# Altium project main-board.PrjPcb
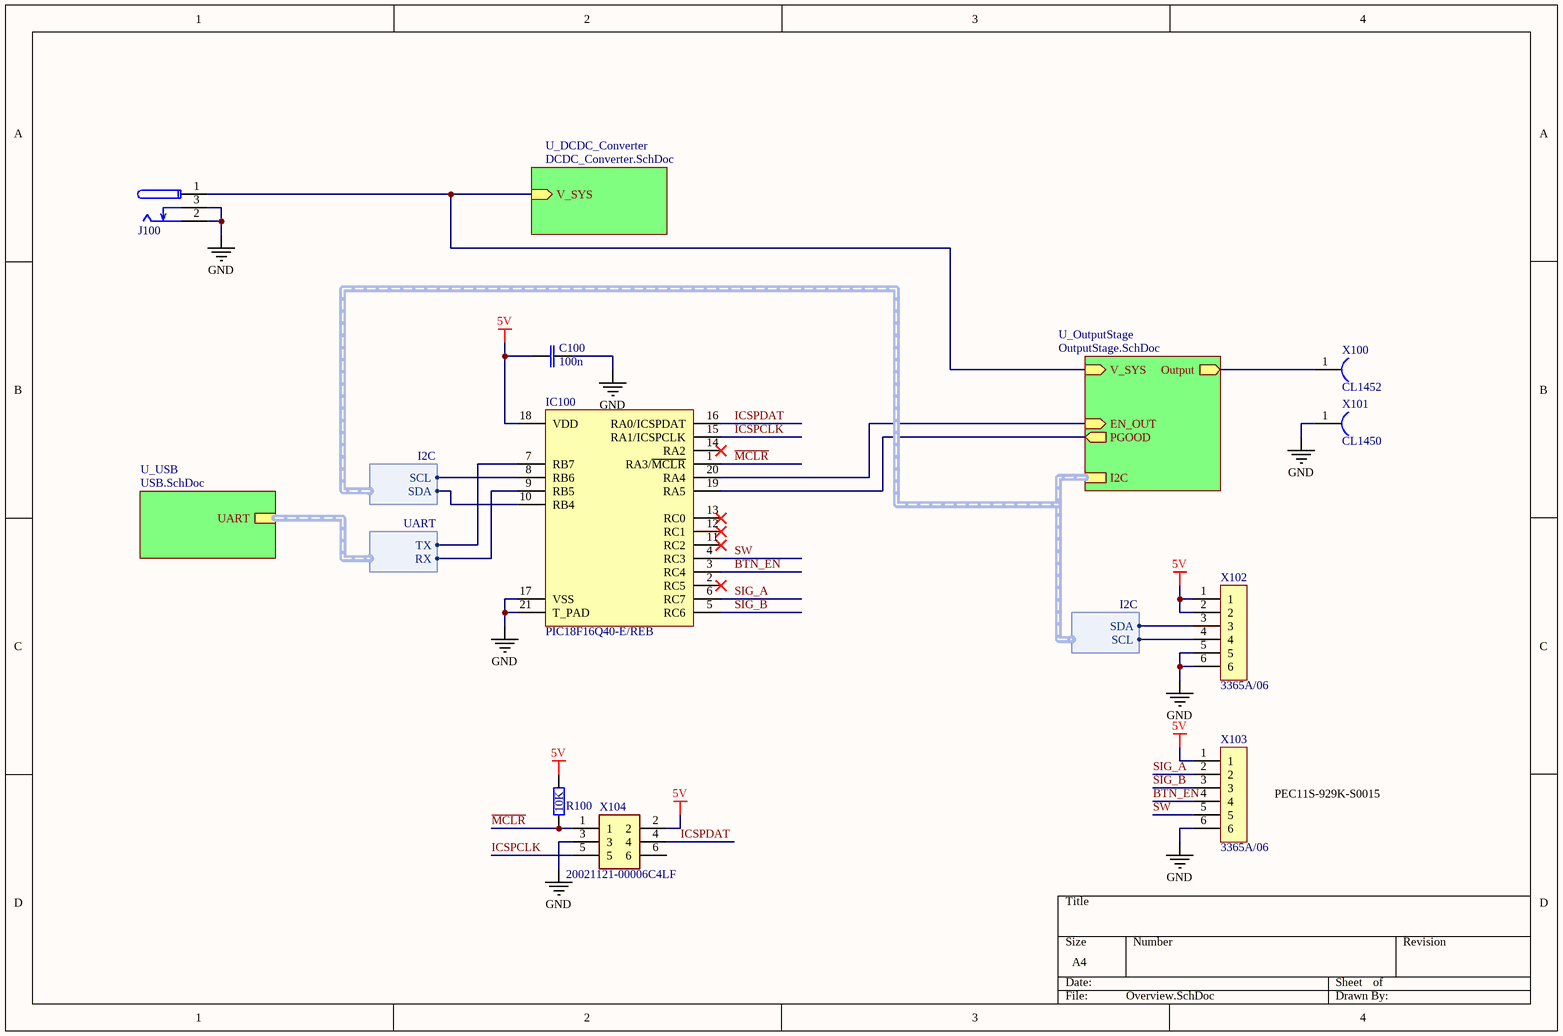
[diagram p0: Overview.SchDoc]
5 sheets, 130 parts. Net scope: hierarchical (ports join the sheet entries above them; power ports are global).
Board file: main-board.PcbDoc
Sheets:
  Overview.SchDoc
    U_OutputStage = OutputStage.SchDoc
      U_Adjustable_DCDC = Adjustable_DCDC.SchDoc
    U_DCDC_Converter = DCDC_Converter.SchDoc
    U_USB = USB.SchDoc

## Sheet Overview.SchDoc
size A4; SheetNumber: 1; SheetTotal: 5

### Parts
C100  100n  [CAP0402]
IC100  PIC18F16Q40-E/REB  [QFN20_3X3(PIC18F16Q40)]
J100  54-00164  [54-00164]  (value not drawn)
R100  10K  [RES0402]  (value not drawn)
X100  CL1452  [THT_Solder_Point]
X101  CL1450  [THT_Solder_Point]
X102  3365A/06  [3M_CBL_RIBN_6X]
X103  3365A/06  [3M_CBL_RIBN_6X]
X104  20021121-00006C4LF  [20021121-00X06CXLF]

### Sub-sheets
U_DCDC_Converter = DCDC_Converter.SchDoc: V_SYS (in)
U_OutputStage = OutputStage.SchDoc: V_SYS (in), EN_OUT (in), PGOOD (out), I2C (harness I2C), Output (out)
U_USB = USB.SchDoc: UART (harness UART)

### Harnesses
I2C: SDA, SCL
UART: RX, TX

### Nets
5V: C100.2 IC100.18(VDD) R100.2 X102.1 X102.2 X103.1 X104.2
GND: C100.1 IC100.17(VSS) IC100.21(T_PAD) J100.2 J100.3 X101.1 X102.5 X102.6 X103.6 X104.3
BTN_EN: IC100.3(RC4) X103.4
EN_OUT: IC100.20(RA4) ; sheet U_OutputStage/EN_OUT
ICSPCLK: IC100.15(RA1/ICSPCLK) X104.5
ICSPDAT: IC100.16(RA0/ICSPDAT) X104.4
~{MCLR}: IC100.1(RA3/~{MCLR}) R100.1 X104.1
Output: X100.1 ; sheet U_OutputStage/Output
PGOOD: IC100.19(RA5) ; sheet U_OutputStage/PGOOD
SCL: IC100.8(RB6) X102.4 ; sheet U_OutputStage/I2C.SCL
SDA: IC100.10(RB4) X102.3 ; sheet U_OutputStage/I2C.SDA
SIG_A: IC100.6(RC7) X103.2
SIG_B: IC100.5(RC6) X103.3
SW: IC100.4(RC3) X103.5
V_SYS: J100.1 ; sheet U_OutputStage/V_SYS, sheet U_DCDC_Converter/V_SYS
NetIC100_7: IC100.7(RB7) ; sheet U_USB/UART.TX
NetIC100_9: IC100.9(RB5) ; sheet U_USB/UART.RX

Not connected (* = marked no-connect by the designer): IC100 2(RC5)* 11(RC2)* 12(RC1)* 13(RC0)* 14(RA2)*; X104 6

### Notes on the sheet
- PEC11S-929K-S0015

### Library data of the parts
C100 = CL05A104KA5NNNC: MaxVoltage: 25V; Dialectric: X5R; Tolerance: 10%; Value: 100n; MPN: CL05A104KA5NNNC
R100 = RC0402JR-0710KL: Power: 0.063W; Tolerance: 5%; Value: 10K; MPN: RC0402JR-0710KL
X104 = 20021121-00006C4LF: Manufacturer: Amphenol ICC (FCI); JLCPCB Part #: C178291; Manufacturer Partnummber: 20021121-00006C4LF; MPN: 20021121-00006C4LF
J100 = 54-00164: MPN: 54-00164
X100 = CL1452: MPN: CL1452
X101 = CL1450: MPN: CL1450
X102 X103 = 3365A/06: MPN: 3365A/06

## Sheet OutputStage.SchDoc
size A3; SheetNumber: 2; SheetTotal: 5
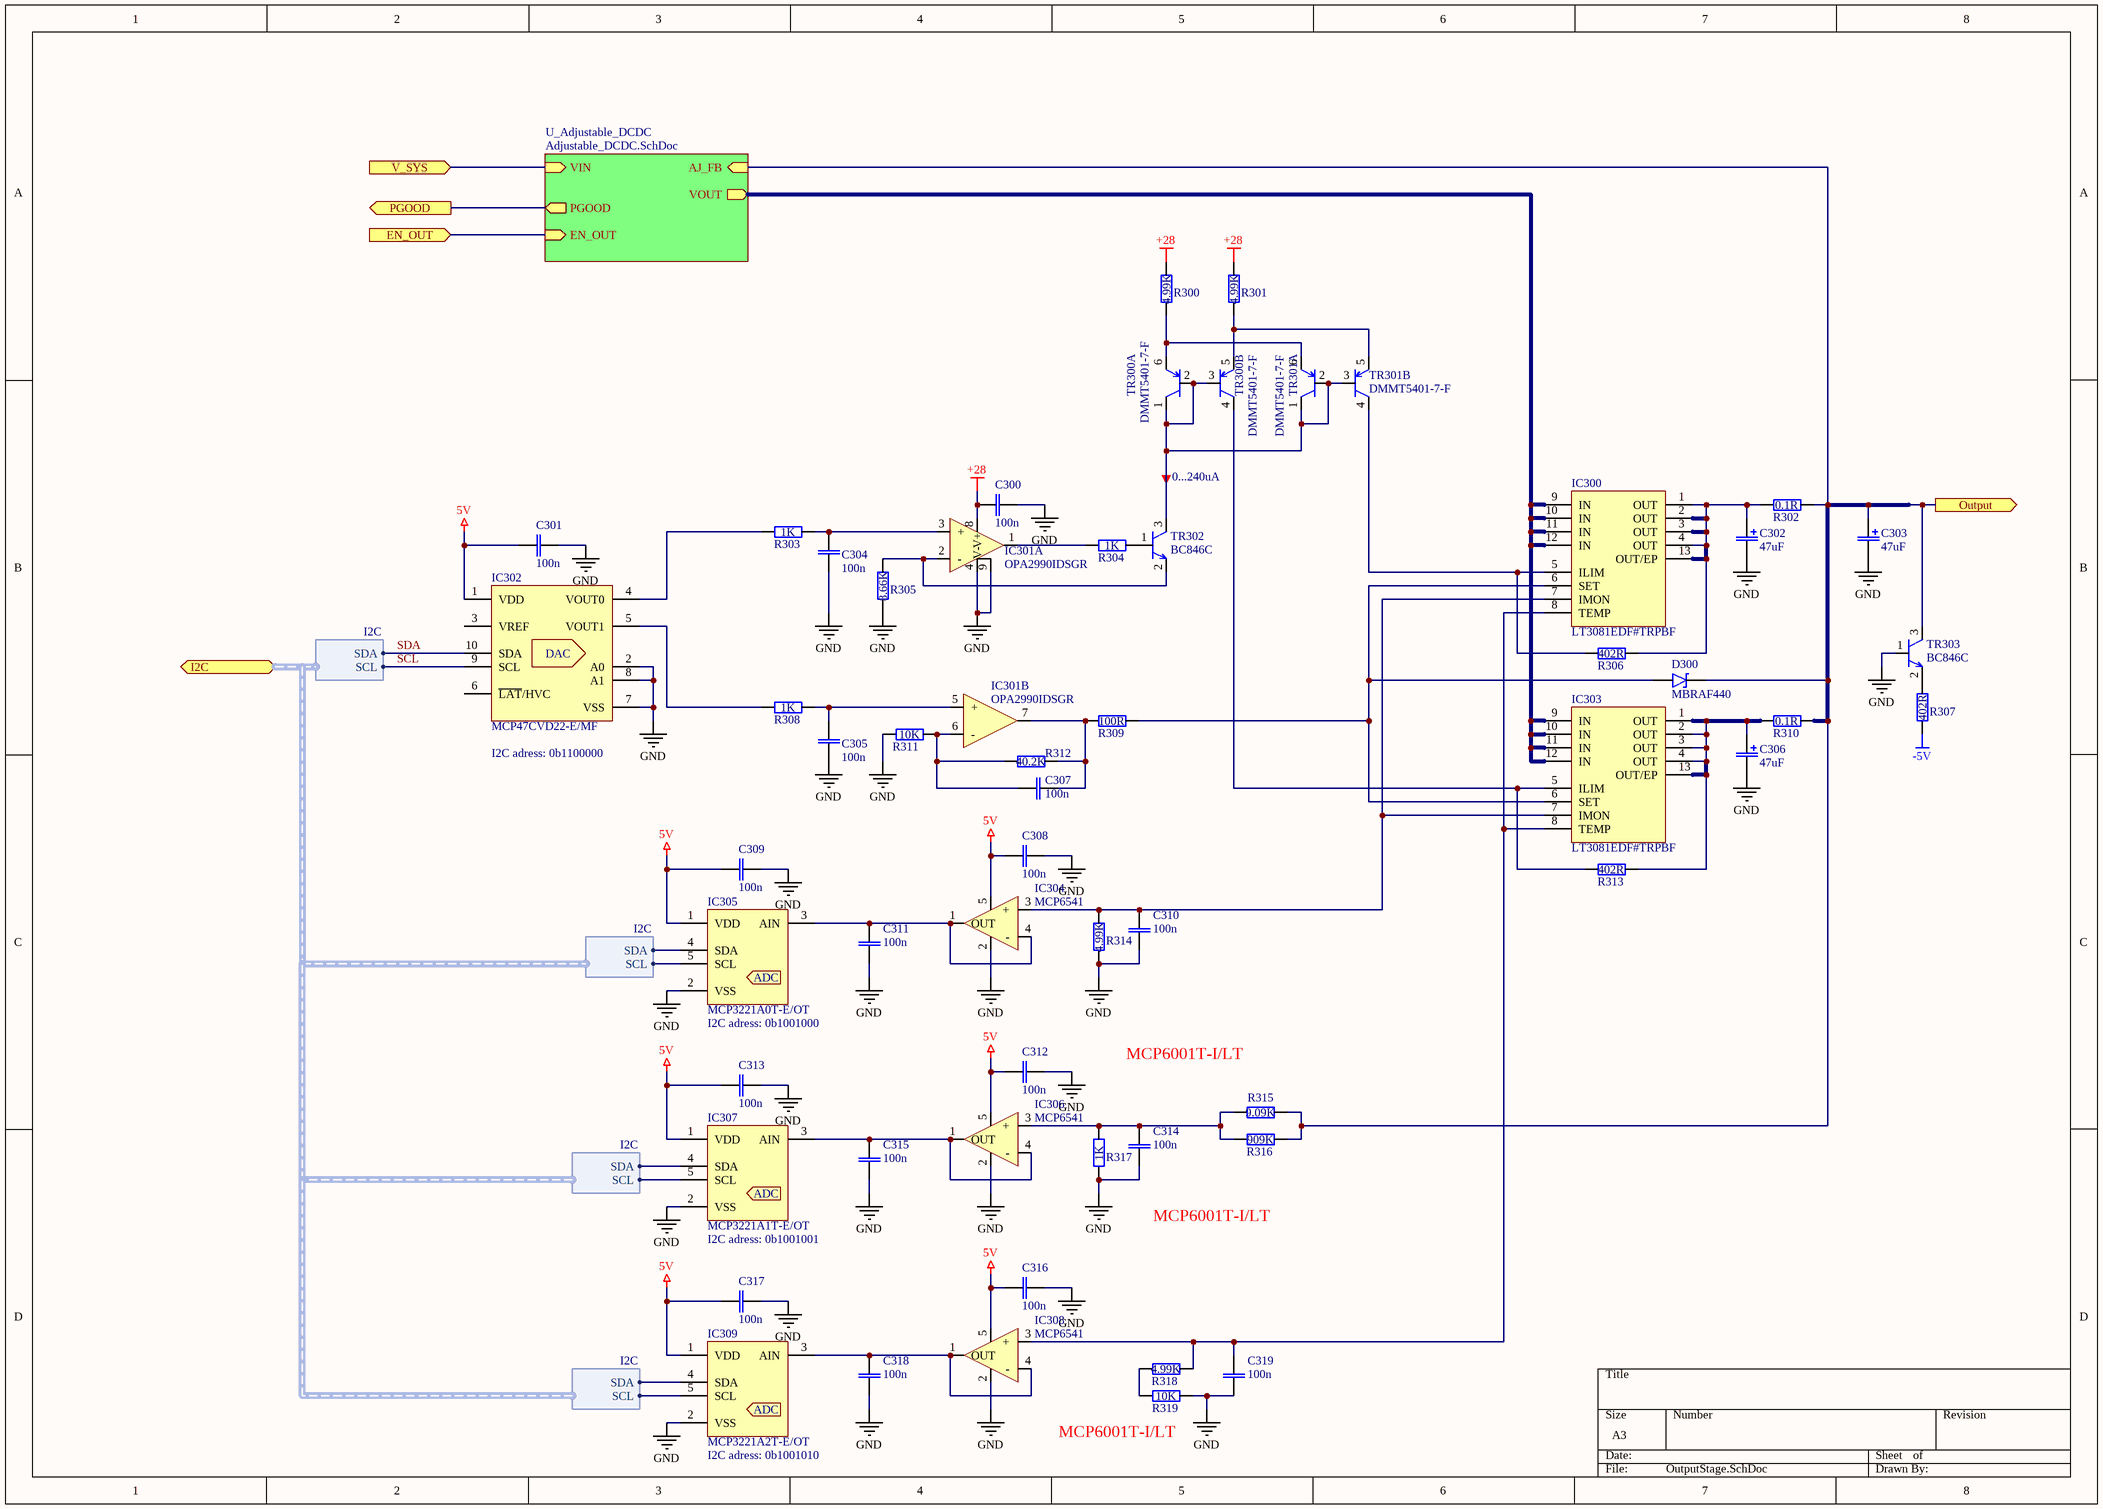
[diagram p1: OutputStage.SchDoc]

### Parts
C300  100n  [CAP0402]
C301  100n  [CAP0402]
C302  47uF  [CHEMICON_KOND_D8H10]
C303  47uF  [CHEMICON_KOND_D8H10]
C304  100n  [CAP0402]
C305  100n  [CAP0402]
C306  47uF  [CHEMICON_KOND_D8H10]
C307  100n  [CAP0402]
C308  100n  [CAP0402]
C309  100n  [CAP0402]
C310  100n  [CAP0402]
C311  100n  [CAP0402]
C312  100n  [CAP0402]
C313  100n  [CAP0402]
C314  100n  [CAP0402]
C315  100n  [CAP0402]
C316  100n  [CAP0402]
C317  100n  [CAP0402]
C318  100n  [CAP0402]
C319  100n  [CAP0402]
D300  MBRAF440  [SMAF]
IC300  LT3081EDF#TRPBF  [WSON12_4X4(LT3081)]
IC301  OPA2990IDSGR  [WSON8(DRV8210)]  (parts A,B of 2)
IC302  MCP47CVD22-E/MF  [WSON10(MCP47CXDX1/2)]
IC303  LT3081EDF#TRPBF  [WSON12_4X4(LT3081)]
IC304  MCP6541  [SOT353/SC-70-5(MCP6541)]
IC305  MCP3221A0T-E/OT  [SOT23-5(MCP73831)]
IC306  MCP6541  [SOT353/SC-70-5(MCP6541)]
IC307  MCP3221A1T-E/OT  [SOT23-5(MCP73831)]
IC308  MCP6541  [SOT353/SC-70-5(MCP6541)]
IC309  MCP3221A2T-E/OT  [SOT23-5(MCP73831)]
R300  RC0402FR-074K99L  [RES0402]  (value not drawn)
R301  RC0402FR-074K99L  [RES0402]  (value not drawn)
R302  RCWE1210R100FKEA  [RES1210]  (value not drawn)
R303  RC0402FR-071KL  [RES0402]  (value not drawn)
R304  RC0402FR-071KL  [RES0402]  (value not drawn)
R305  RC0402FR-078K66L  [RES0402]  (value not drawn)
R306  RC0402FR-07402RL  [RES0402]  (value not drawn)
R307  RC0402FR-07402RL  [RES0402]  (value not drawn)
R308  RC0402FR-071KL  [RES0402]  (value not drawn)
R309  RC0402FR-07100RL  [RES0402]  (value not drawn)
R310  RCWE1210R100FKEA  [RES1210]  (value not drawn)
R311  10K  [RES0402]  (value not drawn)
R312  RC0402FR-0740K2L  [RES0402]  (value not drawn)
R313  RC0402FR-07402RL  [RES0402]  (value not drawn)
R314  RC0402FR-074K99L  [RES0402]  (value not drawn)
R315  RC0402FR-079K09L  [RES0402]  (value not drawn)
R316  RC0402FR-07909KL  [RES0402]  (value not drawn)
R317  RC0402FR-071KL  [RES0402]  (value not drawn)
R318  RC0402FR-074K99L  [RES0402]  (value not drawn)
R319  10K  [RES0402]  (value not drawn)
TR300  DMMT5401-7-F  [SOT95P245X120-6N]  (parts A,B of 2)
TR301  DMMT5401-7-F  [SOT95P245X120-6N]  (parts A,B of 2)
TR302  BC846C  [SOT23(IRLM2244T)]
TR303  BC846C  [SOT23(IRLM2244T)]

### Sub-sheets
U_Adjustable_DCDC = Adjustable_DCDC.SchDoc: EN_OUT (in), PGOOD (out), AJ_FB (in), VIN (in), VOUT (out)

### Ports
EN_OUT (in, see Overview[3B], Adjustable_DCDC[3B]), I2C (bidir, harness I2C, see Overview[3B]), Output (out, see Overview[4B]), PGOOD (out, see Overview[3B], Adjustable_DCDC[3B]), V_SYS (in, see Overview[3B], DCDC_Converter[1A])

### Harnesses
I2C: SDA, SCL

### Nets
5V: C301.2 C308.2 C309.2 C312.2 C313.2 C316.2 C317.2 IC302.1(VDD) IC304.5(VDD) IC305.1(VDD) IC306.5(VDD) IC307.1(VDD) IC308.5(VDD) IC309.1(VDD)
+28: C300.2 IC301.8(V+) R300.2 R301.2
-5V: R307.1
GND: C300.1 C301.1 C302.2 C303.2 C304.2 C305.2 C306.2 C308.1 C309.1 C310.1 C311.1 C312.1 C313.1 C314.1 C315.1 C316.1 C317.1 C318.1 C319.1 IC301.4(V-) IC301.9(EP) IC302.2(A0) IC302.7(VSS) IC302.8(A1) IC304.2(VSS) IC305.2(VSS) IC306.2(VSS) IC307.2(VSS) IC308.2(VSS) IC309.2(VSS) R305.1 R311.1 R314.1 R317.1 R319.2 TR303.1(B)
EN_OUT: port EN_OUT, sheet U_Adjustable_DCDC/EN_OUT
Output: C303.1 D300.1 R302.2 R310.2 R315.2 R316.2 TR303.3(C) ; port Output, sheet U_Adjustable_DCDC/AJ_FB
PGOOD: port PGOOD, sheet U_Adjustable_DCDC/PGOOD
SCL: IC302.9(SCL) IC305.5(SCL) IC307.5(SCL) IC309.5(SCL) ; port I2C.SCL
SDA: IC302.10(SDA) IC305.4(SDA) IC307.4(SDA) IC309.4(SDA) ; port I2C.SDA
V_SYS: port V_SYS, sheet U_Adjustable_DCDC/VIN
VOUT: IC300.9(IN) IC300.10(IN) IC300.11(IN) IC300.12(IN) IC303.9(IN) IC303.10(IN) IC303.11(IN) IC303.12(IN) ; sheet U_Adjustable_DCDC/VOUT
NetC302_1: C302.1 IC300.1(OUT) IC300.2(OUT) IC300.3(OUT) IC300.4(OUT) IC300.13(OUT/EP) R302.1 R306.2
NetC304_1: C304.1 IC301.3(+) R303.2
NetC305_1: C305.1 IC301.5(+) R308.2
NetC306_1: C306.1 IC303.1(OUT) IC303.2(OUT) IC303.3(OUT) IC303.4(OUT) IC303.13(OUT/EP) R310.1 R313.2
NetC307_1: C307.1 IC301.7(OUT) R309.1 R312.2
NetC307_2: C307.2 IC301.6(-) R311.2 R312.1
NetC310_2: C310.2 IC300.7(IMON) IC303.7(IMON) IC304.3(+) R314.2
NetC311_2: C311.2 IC304.1(OUT) IC304.4(-) IC305.3(AIN)
NetC314_2: C314.2 IC306.3(+) R315.1 R316.1 R317.2
NetC315_2: C315.2 IC306.1(OUT) IC306.4(-) IC307.3(AIN)
NetC318_2: C318.2 IC308.1(OUT) IC308.4(-) IC309.3(AIN)
NetC319_2: C319.2 IC300.8(TEMP) IC303.8(TEMP) IC308.3(+) R318.2
NetD300_2: D300.2 IC300.6(SET) IC303.6(SET) R309.2
NetIC300_5: IC300.5(ILIM) R306.1 TR301.4(C)
NetIC301_1: IC301.1(OUT) R304.1
NetIC301_2: IC301.2(-) R305.2 TR302.2(E)
NetIC302_4: IC302.4(VOUT0) R303.1
NetIC302_5: IC302.5(VOUT1) R308.1
NetIC303_5: IC303.5(ILIM) R313.1 TR300.4(C)
NetR300_1: R300.1 TR300.6(E) TR301.6(E)
NetR301_1: R301.1 TR300.5(E) TR301.5(E)
NetR304_2: R304.2 TR302.1(B)
NetR307_2: R307.2 TR303.2(E)
NetR318_1: R318.1 R319.1
NetTR300_1: TR300.1(C) TR300.2(B) TR300.3(B) TR301.1(C) TR301.2(B) TR301.3(B) TR302.3(C)

Not connected (* = marked no-connect by the designer): IC302 3(VREF) 6(~{LAT}/HVC)

### Notes on the sheet
- 0...240uA
- (near IC302) I2C adress: 0b1100000
- (near IC305) I2C adress: 0b1001000
- MCP6001T-I/LT
- (near IC307) I2C adress: 0b1001001
- (near IC309) I2C adress: 0b1001010
- (near R319) MCP6001T-I/LT
- (in symbol MCP47CVD22-E/MF) DAC
- (in symbol MCP3221A0T-E/OT) ADC
- (in symbol MCP3221A1T-E/OT) ADC
- (in symbol MCP3221A2T-E/OT) ADC

### Library data of the parts
C300 C301 C304 C305 C307-C319 = CL05A104KA5NNNC: as C100 on sheet Overview; Value: 100n; MPN: CL05A104KA5NNNC
C302 C303 C306 = HHXC500ARA470MHA0G: MaxVoltage: 50V; Value: 47uF; MPN: HHXC500ARA470MHA0G
IC301 = OPA2990IDSGR: Replacment for LM358D; ComponentLink1Description: Datasheet; ComponentLink1URL: https://www.ti.com/lit/ds/symlink/opa2990.pdf?HQS=dis-dk-null-digikeymode-dsf-pf-null-wwe&ts=1774018374396&ref_url=https%253A%252F%252Fwww.ti.com%252Fgeneral%252Fdocs%252Fsuppproductinfo.tsp%253FdistId%253D10%2526gotoUrl%253Dhttps%253A%252F%252Fwww.ti.com%252Flit%252Fgpn%252Fopa2990; MPN: OPA2990IDSGR
IC304 IC306 IC308 = MCP6541: MPN: MCP6541UT-I/LT
R300 R301 R314 R318 = RC0402FR-074K99L: Value: 4.99K; MPN: RC0402FR-074K99L
R302 R310 = RCWE1210R100FKEA: Value: 0.1R; MPN: RCWE1210R100FKEA
R303 R304 R308 R317 = RC0402FR-071KL: Value: 1K; MPN: RC0402FR-071KL
R305 = RC0402FR-078K66L: Value: 8.66K; MPN: RC0402FR-078K66L
R306 R307 R313 = RC0402FR-07402RL: Value: 402R; MPN: RC0402FR-07402RL
R309 = RC0402FR-07100RL: Value: 100R; MPN: RC0402FR-07100RL
R311 R319 = RC0402JR-0710KL: Power: 0.063W; Tolerance: 5%; Value: 10K; MPN: RC0402JR-0710KL
R312 = RC0402FR-0740K2L: Value: 40.2K; MPN: RC0402FR-0740K2L
R315 = RC0402FR-079K09L: Value: 9.09K; MPN: RC0402FR-079K09L
R316 = RC0402FR-07909KL: Value: 909K; MPN: RC0402FR-07909KL
D300 = MBRAF440: Part Number: MBRAF440; Component Type: Standard; Value: MBRAF440; Digikey Number: MBRAF440T3GOSCT-ND; MPN: MBRAF440
IC300 IC303 = LT3081EDF#TRPBF: MPN: LT3081EDF#TRPBF
IC302 = MCP47CVD22-E/MF: MPN: MCP47CVD22-E/MF
IC305 = MCP3221A0T-E/OT: MPN: MCP3221A0T-E/OT
IC307 = MCP3221A1T-E/OT: MPN: MCP3221A1T-E/OT
IC309 = MCP3221A2T-E/OT: MPN: MCP3221A2T-E/OT
TR300 TR301 = DMMT5401-7-F: MPN: DMMT5401-7-F
TR302 TR303 = BC846C: MPN: BC846C

## Sheet Adjustable_DCDC.SchDoc
size A3; SheetNumber: 3; SheetTotal: 5
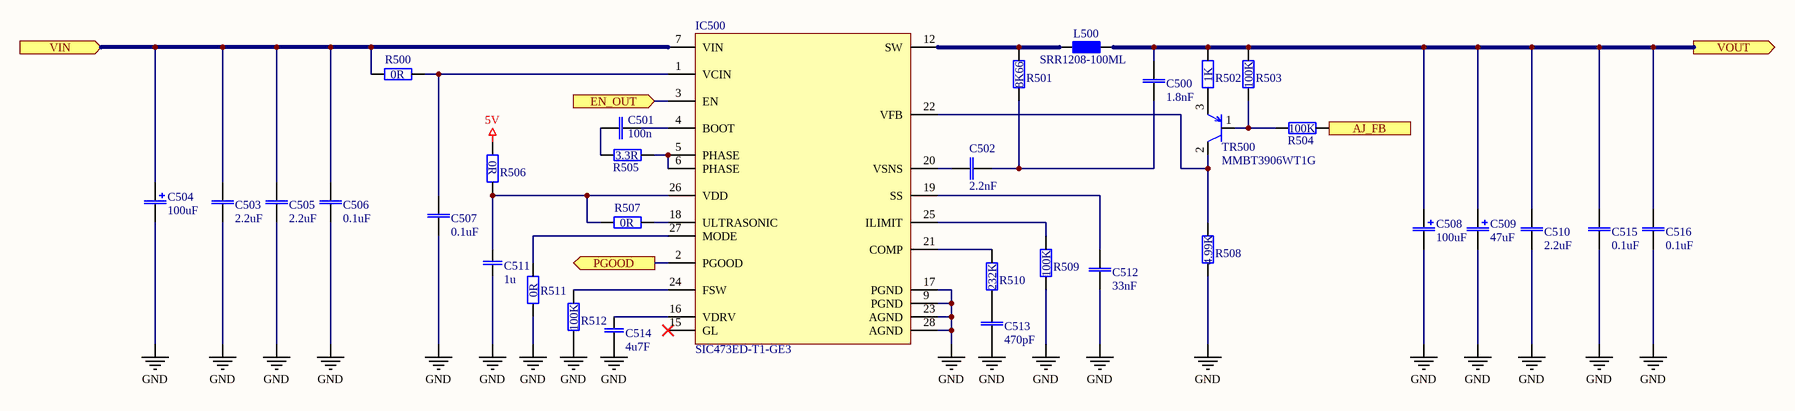
[diagram p2: Adjustable_DCDC.SchDoc]

### Parts
C500  1.8nF  [CAP0402]
C501  100n  [CAP0402]
C502  2.2nF  [CAP0402]
C503  2.2uF  [CAP1206]
C504  100uF  [CHEMICON_D10H10_JA0]
C505  2.2uF  [CAP0805]
C506  0.1uF  [CAP0402]
C507  0.1uF  [CAP0402]
C508  100uF  [CHEMICON_D10H10_JA0]
C509  47uF  [CHEMICON_KOND_D8H10]
C510  2.2uF  [CAP1206]
C511  1u  [0603]
C512  33nF  [CAP0402]
C513  470pF  [CAP0402]
C514  4u7F  [0805]
C515  0.1uF  [CAP0402]
C516  0.1uF  [CAP0402]
IC500  SIC473ED-T1-GE3  [VISCHAY_SiC47X]
L500  SRR1208-100ML  [SRR1208]
R500  0R  [RES0402]  (value not drawn)
R501  RC0402FR-078K66L  [RES0402]  (value not drawn)
R502  RC0402FR-071KL  [RES0402]  (value not drawn)
R503  RC0402FR-07100KL  [RES0402]  (value not drawn)
R504  RC0402FR-07100KL  [RES0402]  (value not drawn)
R505  RC0402FR-073R3L  [RES0402]  (value not drawn)
R506  0R  [RES0402]  (value not drawn)
R507  0R  [RES0402]  (value not drawn)
R508  RC0402FR-074K99L  [RES0402]  (value not drawn)
R509  RC0402FR-07100KL  [RES0402]  (value not drawn)
R510  RC0402FR-07232KL  [RES0402]  (value not drawn)
R511  0R  [RES0402]  (value not drawn)
R512  RC0402FR-07100KL  [RES0402]  (value not drawn)
TR500  MMBT3906WT1G  [SOT323/SC-70(NX6008NBKW)]

### Ports
AJ_FB (in, see OutputStage[3A]), EN_OUT (in, see OutputStage[3A], OutputStage[2A]), PGOOD (out, see OutputStage[3A], OutputStage[2A]), VIN (in, see OutputStage[3A]), VOUT (out, see OutputStage[3A])

### Nets
5V: R506.1
GND: C503.1 C504.2 C505.1 C506.1 C507.1 C508.2 C509.2 C510.1 C511.1 C512.1 C513.1 C514.1 C515.1 C516.1 IC500.9(PGND) IC500.17(PGND) IC500.23(AGND) IC500.28(AGND) R508.1 R509.1 R511.1 R512.1
EN_OUT: IC500.3(EN) ; port EN_OUT
Output: R504.2 ; port AJ_FB
PGOOD: IC500.2(PGOOD) ; port PGOOD
V_SYS: C503.2 C504.1 C505.2 C506.2 IC500.7(VIN) R500.1 ; port VIN
VOUT: C500.2 C508.1 C509.1 C510.2 C515.2 C516.2 L500.2 R502.2 R503.2 ; port VOUT
NetC500_1: C500.1 C502.2 R501.1
NetC501_1: C501.1 IC500.4(BOOT)
NetC501_2: C501.2 R505.1
NetC502_1: C502.1 IC500.20(VSNS)
NetC507_2: C507.2 IC500.1(VCIN) R500.2
NetC511_2: C511.2 IC500.26(VDD) R506.2 R507.1
NetC512_2: C512.2 IC500.19(SS)
NetC513_2: C513.2 R510.1
NetC514_2: C514.2 IC500.16(VDRV)
NetIC500_5: IC500.5(PHASE) IC500.6(PHASE) R505.2
NetIC500_12: IC500.12(SW) L500.1 R501.2
NetIC500_18: IC500.18(ULTRASONIC) R507.2
NetIC500_21: IC500.21(COMP) R510.2
NetIC500_22: IC500.22(VFB) R508.2 TR500.2(E)
NetIC500_24: IC500.24(FSW) R512.2
NetIC500_25: IC500.25(ILIMIT) R509.2
NetIC500_27: IC500.27(MODE) R511.2
NetR502_1: R502.1 TR500.3(C)
NetR503_1: R503.1 R504.1 TR500.1(B)

Not connected (* = marked no-connect by the designer): IC500 15(GL)*

### Notes on the sheet
- (near C512) Current Limit with 100K approx 4A

### Library data of the parts
C500 = CC0402KPX7R9BB182: MaxVoltage: 50V; Value: 1.8nF; MPN: CC0402KPX7R9BB182
C501 = CL05A104KA5NNNC: as C100 on sheet Overview; Value: 100n; MPN: CL05A104KA5NNNC
C502 = CC0402KRX7R9BB222: MaxVoltage: 50V; Value: 2.2nF; MPN: CC0402KRX7R9BB222
C503 C510 = CL31B225KCHSNNE: MaxVoltage: 100V; Value: 2.2uF; MPN: CL31B225KCHSNNE
C504 C508 = EMVE630ARA101MJA0G: MaxVoltage: 63V; Value: 100uF; MPN: EMVE630ARA101MJA0G
C505 = GRM21BD72A225ME01K: 0805; MaxVoltage: 100V; Value: 2.2uF; MPN: GRM21BD72A225ME01K
C506 C507 C515 C516 = GRM155R62A104KE14D: 0805; MaxVoltage: 100V; Value: 0.1uF; MPN: GRM155R62A104KE14D
C509 = HHXC500ARA470MHA0G: MaxVoltage: 50V; Value: 47uF; MPN: HHXC500ARA470MHA0G
C511 = 000088: Part Number: 000088; Component Type: Standard; ComponentLink1Description: Datasheet; ComponentLink2Description: Manufacturer Site; Value: 1u
C512 = C0402C333K4RECTU: MaxVoltage: 16; Value: 33nF; MPN: C0402C333K4RECTU
C513 = CL05B471KB5NNNC: MaxVoltage: 50V; Value: 470pF; MPN: CL05B471KB5NNNC
C514 = 000090: Part Number: 000090; MPN: CL21A475KOFNNNE; Component Type: Standard; ComponentLink1Description: Datasheet; ComponentLink2Description: Manufacturer Site; Value: 4u7F; Digikey Number: 1276-1065-1-ND
R500 R506 R507 R511 = RES_0402: MPN: RC0402JR-070RL; Value: 0R
R501 = RC0402FR-078K66L: Value: 8K66; MPN: RC0402FR-078K66L
R502 = RC0402FR-071KL: Value: 1K; MPN: RC0402FR-071KL
R503 R504 R509 R512 = RC0402FR-07100KL: Value: 100K; MPN: RC0402FR-07100KL
R505 = RC0402FR-073R3L: Value: 3.3R; MPN: RC0402FR-073R3L
R508 = RC0402FR-074K99L: Value: 4.99K; MPN: RC0402FR-074K99L
R510 = RC0402FR-07232KL: Value: 232K; MPN: RC0402FR-07232KL
IC500 = SIC473ED-T1-GE3: MPN: SIC473ED-T1-GE3
L500 = SRR1208-100ML: MPN: SRR1208-100ML
TR500 = MMBT3906WT1G: MPN: MMBT3906WT1G

## Sheet DCDC_Converter.SchDoc
size A4; SheetNumber: 4; SheetTotal: 5
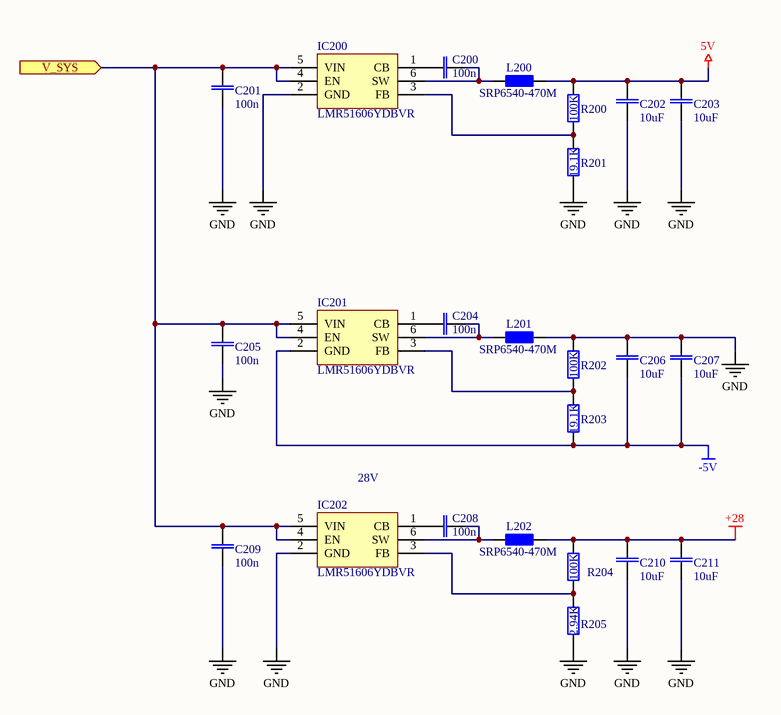
[diagram p3: DCDC_Converter.SchDoc]

### Parts
C200  100n  [CAP0402]
C201  100n  [CAP0402]
C202  10uF  [CAP0402]
C203  10uF  [CAP0402]
C204  100n  [CAP0402]
C205  100n  [CAP0402]
C206  10uF  [CAP0402]
C207  10uF  [CAP0402]
C208  100n  [CAP0402]
C209  100n  [CAP0402]
C210  10uF  [CAP0603]
C211  10uF  [CAP0603]
IC200  LMR51606YDBVR  [SOT95P245X120-6N]
IC201  LMR51606YDBVR  [SOT95P245X120-6N]
IC202  LMR51606YDBVR  [SOT95P245X120-6N]
L200  SRP6540-470M  [SRP6540]
L201  SRP6540-470M  [SRP6540]
L202  SRP6540-470M  [SRP6540]
R200  RC0402FR-07100KL  [RES0402]  (value not drawn)
R201  RC0402FR-0719K1L  [RES0402]  (value not drawn)
R202  RC0402FR-07100KL  [RES0402]  (value not drawn)
R203  RC0402FR-0719K1L  [RES0402]  (value not drawn)
R204  RC0402FR-07100KL  [RES0402]  (value not drawn)
R205  RC0402FR-072K94L  [RES0402]  (value not drawn)

### Ports
V_SYS (in, see Overview[2A], OutputStage[2A])

### Nets
5V: C202.2 C203.2 L200.2 R200.2
+28: C210.2 C211.2 L202.2 R204.2
-5V: C206.1 C207.1 IC201.2(GND) R203.1
GND: C201.2 C202.1 C203.1 C205.2 C206.2 C207.2 C209.2 C210.1 C211.1 IC200.2(GND) IC202.2(GND) L201.2 R201.1 R202.2 R205.1
V_SYS: C201.1 C205.1 C209.1 IC200.4(EN) IC200.5(VIN) IC201.4(EN) IC201.5(VIN) IC202.4(EN) IC202.5(VIN) ; port V_SYS
NetC200_1: C200.1 IC200.6(SW) L200.1
NetC200_2: C200.2 IC200.1(CB)
NetC204_1: C204.1 IC201.6(SW) L201.1
NetC204_2: C204.2 IC201.1(CB)
NetC208_1: C208.1 IC202.6(SW) L202.1
NetC208_2: C208.2 IC202.1(CB)
NetIC200_3: IC200.3(FB) R200.1 R201.2
NetIC201_3: IC201.3(FB) R202.1 R203.2
NetIC202_3: IC202.3(FB) R204.1 R205.2

### Notes on the sheet
- (near IC202) 28V

### Library data of the parts
C200 C201 C204 C205 C208 C209 = CL05A104KA5NNNC: as C100 on sheet Overview; Value: 100n; MPN: CL05A104KA5NNNC
C202 C203 C206 C207 = GRM155R61A106ME11D: MPN: CC0402KRX7R9BB222; MaxVoltage: 50V; Value: 10uF
C210 C211 = GRM188R6YA106MA73D: MPN: CL05A475MP5NRNC; MaxVoltage: 10V; Dialectric: X5R; Tolerance: 20%; Value: 10uF
R200 R202 R204 = RC0402FR-07100KL: Value: 100K; MPN: RC0402FR-07100KL
R201 R203 = RC0402FR-0719K1L: Value: 19.1K; MPN: RC0402FR-0719K1L
R205 = RC0402FR-072K94L: Value: 2.94K; MPN: RC0402FR-072K94L
IC200-IC202 = LMR51606YDBVR: MPN: LMR51606YDBVR
L200-L202 = SRP6540-470M: MPN: SRP6540-470M

## Sheet USB.SchDoc
size A4; SheetNumber: 5; SheetTotal: 5
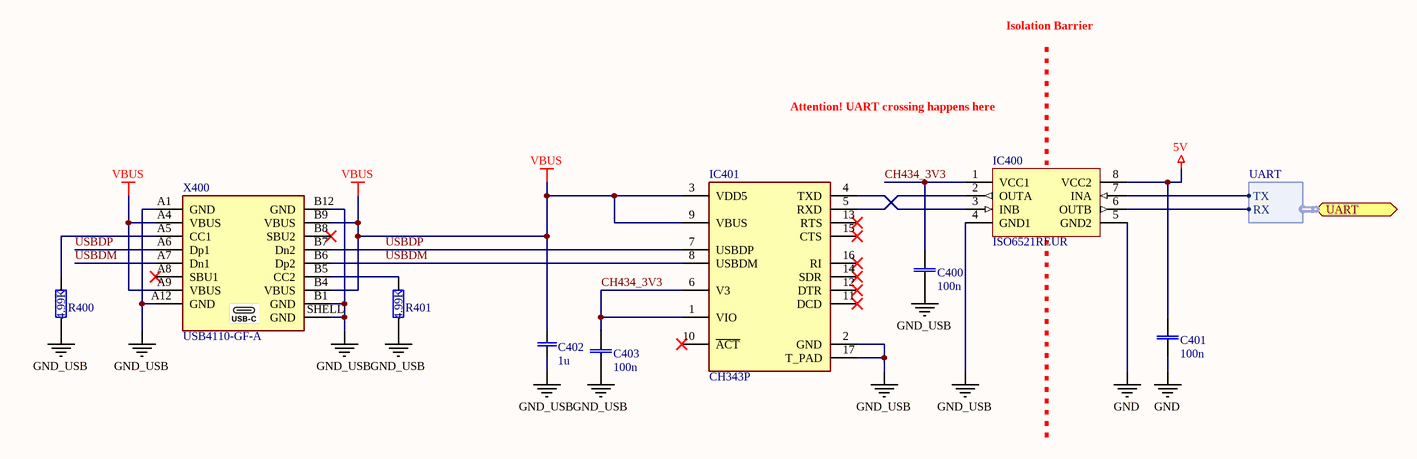
[diagram p4: USB.SchDoc]

### Parts
C400  100n  [CAP0402]
C401  100n  [CAP0402]
C402  1u  [0603]
C403  100n  [CAP0402]
IC400  ISO6521REUR  [VSON8(ISO6521REUR)]
IC401  CH343P  [QFN16_3X3]
R400  RC0402FR-074K99L  [RES0402]  (value not drawn)
R401  RC0402FR-074K99L  [RES0402]  (value not drawn)
X400  USB4110-GF-A  [USB4110]

### Ports
UART (bidir, harness UART, see Overview[1C])

### Harnesses
UART: RX, TX

### Nets
5V: C401.1 IC400.8(VCC2)
GND: C401.2 IC400.5(GND2)
GND_USB: C400.2 C402.1 C403.2 IC400.4(GND1) IC401.2(GND) IC401.17(T_PAD) R400.1 R401.1 X400.A1(GND) X400.A12(GND) X400.B1(GND) X400.B12(GND) X400.SHELL(GND)
VBUS: C402.2 IC401.3(VDD5) IC401.9(VBUS) X400.A4(VBUS) X400.A9(VBUS) X400.B4(VBUS) X400.B9(VBUS)
CH434_3V3: C400.1 C403.1 IC400.1(VCC1) IC401.1(VIO) IC401.6(V3)
USBDM: IC401.8(USBDM) X400.A7(Dn1) X400.B6(Dp2)
USBDP: IC401.7(USBDP) X400.A6(Dp1) X400.B7(Dn2)
NetIC100_7: IC400.7(INA) ; port UART.TX
NetIC100_9: IC400.6(OUTB) ; port UART.RX
NetIC400_2: IC400.2(OUTA) IC401.5(RXD)
NetIC400_3: IC400.3(INB) IC401.4(TXD)
NetR400_2: R400.2 X400.A5(CC1)
NetR401_2: R401.2 X400.B5(CC2)

Not connected (* = marked no-connect by the designer): IC401 10(~{ACT})* 11(DCD)* 12(DTR)* 13(RTS)* 14(SDR)* 15(CTS)* 16(RI)*; X400 A8(SBU1)* B8(SBU2)*

### Notes on the sheet
- Isolation Barrier
- Attention! UART crossing happens here

### Library data of the parts
C400 C401 C403 = CL05A104KA5NNNC: as C100 on sheet Overview; Value: 100n; MPN: CL05A104KA5NNNC
C402 = 000088: Part Number: 000088; Component Type: Standard; ComponentLink1Description: Datasheet; ComponentLink2Description: Manufacturer Site; Value: 1u
IC401 = CH343P: Manufacturer: WCH; JLCPCB Part #: C2846043; Manufacturer Partnummber: CH343P; MPN: CH343P
R400 R401 = RC0402FR-074K99L: Value: 4.99K; MPN: RC0402FR-074K99L
IC400 = ISO6521REUR: MPN: ISO6521REUR
X400 = USB4110-GF-A: MPN: USB4110-GF-A

## Nets that join several sheets
5V: Overview (7 pins), OutputStage (14 pins), Adjustable_DCDC (R506.1), DCDC_Converter (C202.2 C203.2 L200.2 R200.2), USB (C401.1 IC400.8)
+28: OutputStage (C300.2 IC301.8 R300.2 R301.2), DCDC_Converter (C210.2 C211.2 L202.2 R204.2)
-5V: OutputStage (R307.1), DCDC_Converter (C206.1 C207.1 IC201.2 R203.1)
GND: Overview (10 pins), OutputStage (36 pins), Adjustable_DCDC (22 pins), DCDC_Converter (15 pins), USB (C401.2 IC400.5)
EN_OUT: Overview (IC100.20), Adjustable_DCDC (IC500.3)
NetIC100_7: Overview (IC100.7), USB (IC400.7)
NetIC100_9: Overview (IC100.9), USB (IC400.6)
Output: Overview (X100.1), OutputStage (7 pins), Adjustable_DCDC (R504.2)
PGOOD: Overview (IC100.19), Adjustable_DCDC (IC500.2)
SCL: Overview (IC100.8 X102.4), OutputStage (IC302.9 IC305.5 IC307.5 IC309.5)
SDA: Overview (IC100.10 X102.3), OutputStage (IC302.10 IC305.4 IC307.4 IC309.4)
V_SYS: Overview (J100.1), Adjustable_DCDC (6 pins), DCDC_Converter (9 pins)
VOUT: OutputStage (8 pins), Adjustable_DCDC (9 pins)